# EAGLE schematic tlc5940 (EAGLE 6.6.0)
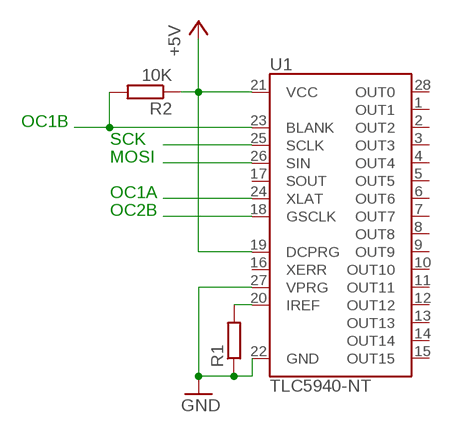
[diagram p0: schematic, sheet 1]

## Parts
R1  R-EU_0207/10  [0207/10]
R2  10K  R-EU_0207/10  [0207/10]
U1  TLC5940-NT  [DIL28-3]

## Nets
+5V: R2.1 U1.19(DCPRG) U1.21(VCC)
GND: R1.1 U1.22(GND) U1.27(VPRG)
N$1: U1.26(SIN)
N$2: U1.25(SCLK)
N$3: U1.24(XLAT)
N$4: R2.2 U1.23(BLANK)
N$5: U1.18(GSCLK)
N$6: R1.2 U1.20(IREF)
Unconnected: U1.1(OUT1) U1.2(OUT2) U1.3(OUT3) U1.4(OUT4) U1.5(OUT5) U1.6(OUT6) U1.7(OUT7) U1.8(OUT8) U1.9(OUT9) U1.10(OUT10) U1.11(OUT11) U1.12(OUT12) U1.13(OUT13) U1.14(OUT14) U1.15(OUT15) U1.16(XERR) U1.17(SOUT) U1.28(OUT0)

## Notes on the sheet
- OC1B
- SCK
- MOSI
- OC1A
- OC2B

## Library data of the parts
R1 R2 = rcl:R-EU_: RESISTOR, European symbol
U1 = SparkFun-DigitalIC:TLC5940: 16-channel LED Driver with Dot Correction and Grayscale PWM Control The TLC5940 is a 16-channel, constant-current sink LED driver. Each channel has an individually adjustable 4096-step grayscale PWM brightness control and a 64-step, constant-current sink (dot correction). The dot correction adjusts the brightness variations between LED channels and other LED drivers. The dot correction data is stored in an integrated EEPROM. Both grayscale control and dot correction are accessible via a serial interface. A single external resistor sets the maximum current value of all 16 channels. Packages: 28-pin HTSSOP 32-pin 5x5mm QFN 28-pin DIP